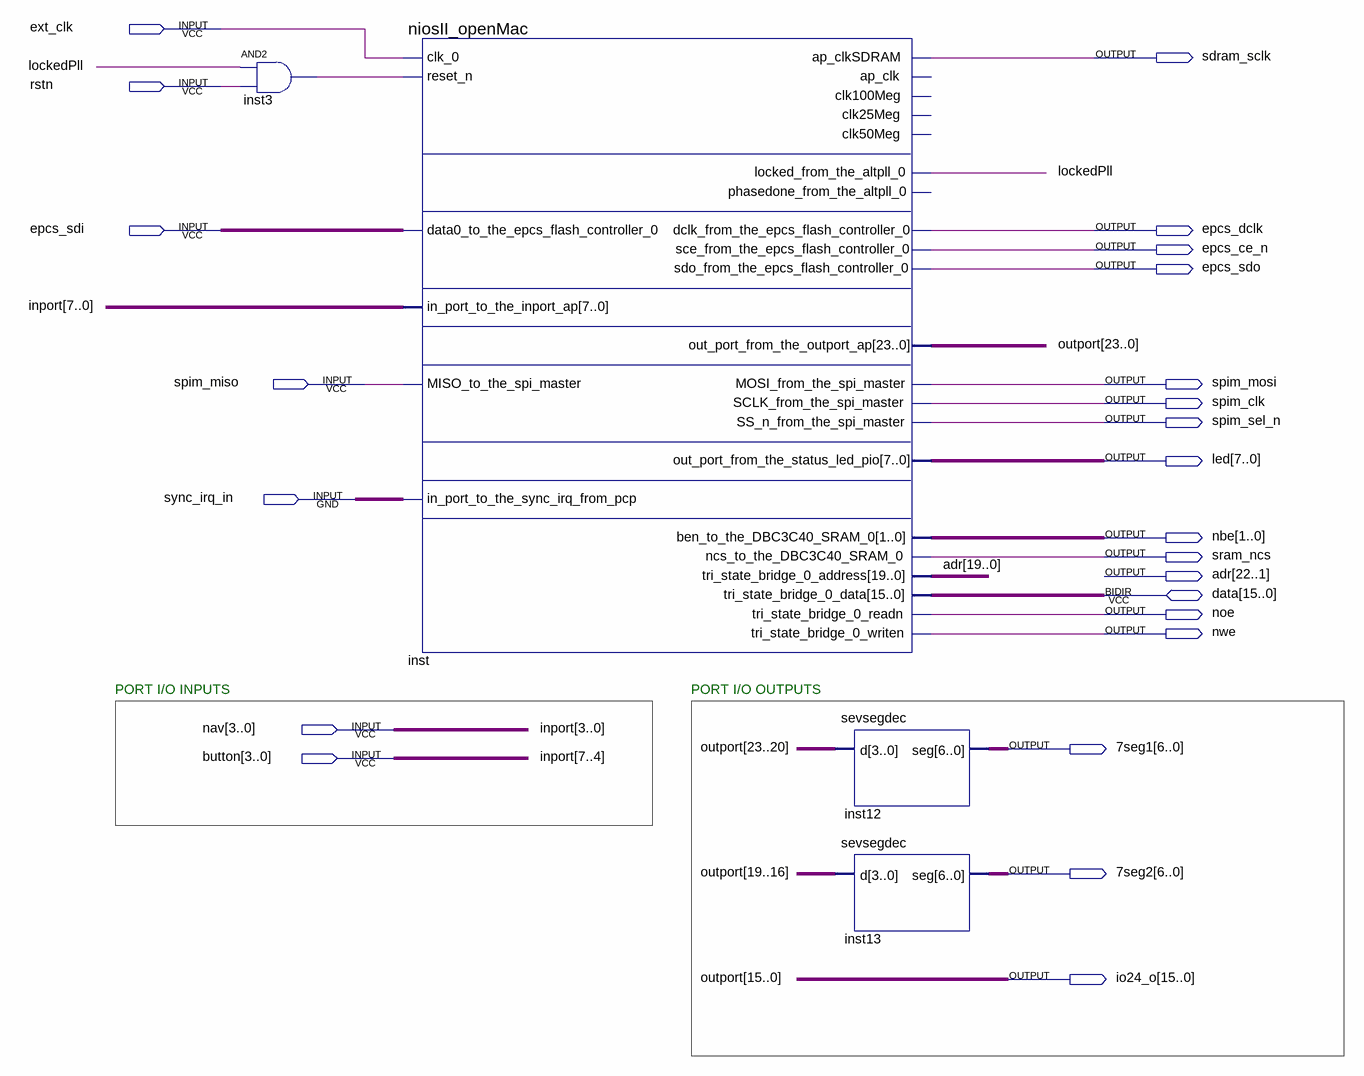
[diagram p0: schematic sheet]
// Quartus schematic nios_pll.bdf as structural Verilog: 4 symbols, 24 pins
module nios_pll (
  input  ext_clk,
  input  rstn,
  input  epcs_sdi,
  input  spim_miso,
  input  sync_irq_in,
  input  [3:0] nav,
  input  [3:0] button,
  inout  [15:0] data,
  output sdram_sclk,
  output epcs_dclk,
  output epcs_ce_n,
  output epcs_sdo,
  output spim_mosi,
  output spim_clk,
  output spim_sel_n,
  output [7:0] led,
  output [1:0] nbe,
  output sram_ncs,
  output [22:0] adr,
  output noe,
  output nwe,
  output [6:0] \7seg1 ,
  output [6:0] \7seg2 ,
  output [15:0] io24_o
);

  wire inst3_out, lockedPll;
  wire [23:16] outport;

  and inst3 (inst3_out, lockedPll, rstn);
  niosII_openMac inst (
    .clk_0(ext_clk), .reset_n(inst3_out), .data0_to_the_epcs_flash_controller_0(epcs_sdi),
    .in_port_to_the_inport_ap({button, nav}), .MISO_to_the_spi_master(spim_miso),
    .in_port_to_the_sync_irq_from_pcp(sync_irq_in), .ap_clkSDRAM(sdram_sclk),
    .locked_from_the_altpll_0(lockedPll), .dclk_from_the_epcs_flash_controller_0(epcs_dclk),
    .sce_from_the_epcs_flash_controller_0(epcs_ce_n), .sdo_from_the_epcs_flash_controller_0(epcs_sdo),
    .out_port_from_the_outport_ap({outport, io24_o}), .MOSI_from_the_spi_master(spim_mosi),
    .SCLK_from_the_spi_master(spim_clk), .SS_n_from_the_spi_master(spim_sel_n),
    .out_port_from_the_status_led_pio(led), .ben_to_the_DBC3C40_SRAM_0(nbe),
    .ncs_to_the_DBC3C40_SRAM_0(sram_ncs), .tri_state_bridge_0_address(adr[19:0]),
    .tri_state_bridge_0_readn(noe), .tri_state_bridge_0_writen(nwe), .tri_state_bridge_0_data(data));  // open: ap_clk, clk100Meg, clk25Meg, clk50Meg, phasedone_from_the_altpll_0
  sevsegdec inst12 (.d(outport[23:20]), .seg(\7seg1 ));
  sevsegdec inst13 (.d(outport[19:16]), .seg(\7seg2 ));

  // Other names for the same wires on the sheet: inport[7:0] = {button, nav}; outport[15:0] = io24_o

  // Notes on the sheet:
  //   PORT I/O INPUTS
  //   PORT I/O OUTPUTS
endmodule
